# Altium schematic sheet CellMonitorV2.SchDoc
size A2 portrait
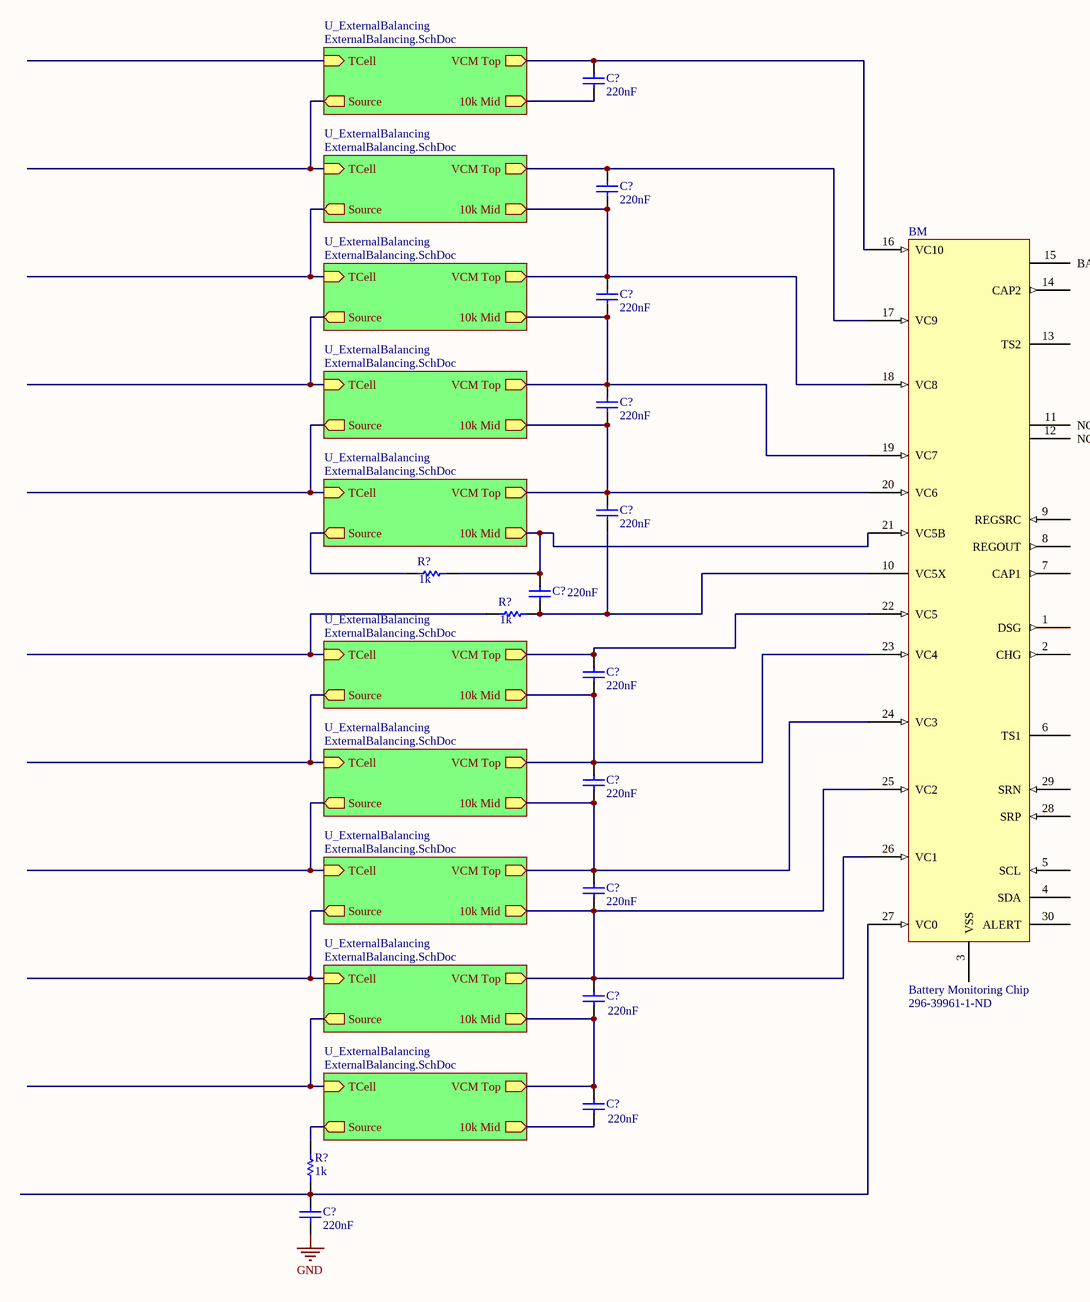
[diagram p0: CellMonitorV2.SchDoc]

## Parts
(Parts that share a designator on the sheet are numbered #1, #2 ... from top to bottom, then left to right.)
BM  Battery Monitoring Chip  Supplier Part Number 1: 296-39961-1-ND  [TSSOP50P640X120-30N]
C?#1  220nF  [CAPC2013X145X50ML20T25]
C?#2  220nF  [CAPC2013X145X50ML20T25]
C?#3  220nF  [CAPC2013X145X50ML20T25]
C?#4  220nF  [CAPC2013X145X50ML20T25]
C?#5  220nF  [CAPC2013X145X50ML20T25]
C?#6  220nF  [CAPC2013X145X50ML20T25]
C?#7  220nF  [CAPC2013X145X50ML20T25]
C?#8  220nF  [CAPC2013X145X50ML20T25]
C?#9  220nF  [CAPC2013X145X50ML20T25]
C?#10  220nF  [CAPC2013X145X50ML20T25]
C?#11  220nF  [CAPC2013X145X50ML20T25]
C?#12  220nF  [CAPC2013X145X50ML20T25]
R?#1  1k  [RESC1608X55X30ML15T15]
R?#2  1k  [RESC1608X55X30ML15T15]
R?#3  1k  [RESC1608X55X30ML15T15]

## Sub-sheets
U_ExternalBalancing = ExternalBalancing.SchDoc: TCell (in), Source (out), 10k Mid (out), VCM Top (out)
U_ExternalBalancing = ExternalBalancing.SchDoc: TCell (in), Source (out), 10k Mid (out), VCM Top (out)
U_ExternalBalancing = ExternalBalancing.SchDoc: TCell (in), Source (out), 10k Mid (out), VCM Top (out)
U_ExternalBalancing = ExternalBalancing.SchDoc: TCell (in), Source (out), 10k Mid (out), VCM Top (out)
U_ExternalBalancing = ExternalBalancing.SchDoc: TCell (in), Source (out), 10k Mid (out), VCM Top (out)
U_ExternalBalancing = ExternalBalancing.SchDoc: TCell (in), Source (out), 10k Mid (out), VCM Top (out)
U_ExternalBalancing = ExternalBalancing.SchDoc: TCell (in), Source (out), 10k Mid (out), VCM Top (out)
U_ExternalBalancing = ExternalBalancing.SchDoc: TCell (in), Source (out), 10k Mid (out), VCM Top (out)
U_ExternalBalancing = ExternalBalancing.SchDoc: TCell (in), Source (out), 10k Mid (out), VCM Top (out)
U_ExternalBalancing = ExternalBalancing.SchDoc: TCell (in), Source (out), 10k Mid (out), VCM Top (out)

## Nets
GND: C?#12.1
NetBM_10: BM.10(VC5X) C?#5.1 C?#6.1 R?#2.2
NetBM_16: BM.16(VC10) C?#1.2 ; sheet U_ExternalBalancing/VCM Top
NetBM_17: BM.17(VC9) C?#2.2 ; sheet U_ExternalBalancing/VCM Top
NetBM_18: BM.18(VC8) C?#2.1 C?#3.2 ; sheet U_ExternalBalancing/10k Mid, sheet U_ExternalBalancing/VCM Top
NetBM_19: BM.19(VC7) C?#3.1 C?#4.2 ; sheet U_ExternalBalancing/10k Mid, sheet U_ExternalBalancing/VCM Top
NetBM_20: BM.20(VC6) C?#4.1 C?#5.2 ; sheet U_ExternalBalancing/10k Mid, sheet U_ExternalBalancing/VCM Top
NetBM_21: BM.21(VC5B) C?#6.2 R?#1.2 ; sheet U_ExternalBalancing/10k Mid
NetBM_22: BM.22(VC5) C?#7.2 ; sheet U_ExternalBalancing/VCM Top
NetBM_23: BM.23(VC4) C?#7.1 C?#8.2 ; sheet U_ExternalBalancing/10k Mid, sheet U_ExternalBalancing/VCM Top
NetBM_24: BM.24(VC3) C?#8.1 C?#9.2 ; sheet U_ExternalBalancing/10k Mid, sheet U_ExternalBalancing/VCM Top
NetBM_25: BM.25(VC2) BM.26(VC1) C?#9.1 C?#10.2 ; sheet U_ExternalBalancing/10k Mid, sheet U_ExternalBalancing/VCM Top
NetBM_27: BM.27(VC0) C?#12.2 R?#3.1
NetC?#1_1: C?#1.1 ; sheet U_ExternalBalancing/10k Mid
NetC?#10_1: C?#10.1 C?#11.2 ; sheet U_ExternalBalancing/10k Mid, sheet U_ExternalBalancing/VCM Top
NetC?#11_1: C?#11.1 ; sheet U_ExternalBalancing/10k Mid
NetR?#1_1: R?#1.1 ; sheet U_ExternalBalancing/Source
NetR?#2_1: R?#2.1 ; sheet U_ExternalBalancing/TCell
NetR?#3_2: R?#3.2 ; sheet U_ExternalBalancing/Source
(unnamed): sheet U_ExternalBalancing/Source, sheet U_ExternalBalancing/TCell
(unnamed): sheet U_ExternalBalancing/Source, sheet U_ExternalBalancing/TCell
(unnamed): sheet U_ExternalBalancing/Source, sheet U_ExternalBalancing/TCell
(unnamed): sheet U_ExternalBalancing/Source, sheet U_ExternalBalancing/TCell
(unnamed): sheet U_ExternalBalancing/Source, sheet U_ExternalBalancing/TCell
(unnamed): sheet U_ExternalBalancing/Source, sheet U_ExternalBalancing/TCell
(unnamed): sheet U_ExternalBalancing/Source, sheet U_ExternalBalancing/TCell
(unnamed): sheet U_ExternalBalancing/Source, sheet U_ExternalBalancing/TCell

Not connected (* = marked no-connect by the designer): BM 1(DSG) 2(CHG) 3(VSS) 4(SDA) 5(SCL) 6(TS1) 7(CAP1) 8(REGOUT) 9(REGSRC) 11(NC) 12(NC) 13(TS2) 14(CAP2) 15(BAT) 28(SRP) 29(SRN) 30(ALERT)

## Library data of the parts
BM = BQ76930: Battery Monitoring/Fuel Gauge Li-Ion/Li-Polymer/LiFePO4 0V to 16V 30-Pin TSSOP T/R; InternalPart: Test1234; Manufacturer: Texas Instruments; Manufacturer Part Number: BQ7693003DBTR; Operating Supply Voltage: 25V; Interface: I2C; Fault Protection: Over Current,Short Circuit,Over/Under Voltage; Supplier 1: Digi-Key; RoHS: Yes; Category: Battery Management; Stock 1: 4521; Pricing 1: 1=4.66000, 10=4.18900, 25=3.96000, 100=3.25600, 250=2.92160, 500=2.81600, 1000=2.34080 (USD); Mount: Surface Mount; Case/Package: TFSOP; Number of Pins: 30; Weight: 0.003439oz; Contact Plating: Gold; Min Operating Temperature: -40°C; Max Operating Temperature: 85°C; Output Voltage: 16V; Packaging: Tape and Reel; Package Quantity: 2000; Lead Free: Lead Free; ComponentLink1URL: http://www.ti.com/lit/gpn/bq76930?src-supplier=Mouser; ComponentLink1Description: http://www.ti.com/lit/gpn/bq76930?src-supplier=Mouser; ComponentLink2URL: http://www.ti.com/lit/ds/symlink/bq76930.pdf?src-supplier=Digi-Key; ComponentLink2Description: http://www.ti.com/lit/ds/symlink/bq76930.pdf?src-supplier=Digi-Key; ComponentLink3URL: http://www.ti.com/lit/pdf/slpt038?src-supplier=Digi-Key; ComponentLink3Description: http://www.ti.com/lit/pdf/slpt038?src-supplier=Digi-Key; ComponentLink4URL: http://www.ti.com/general/docs/lit/getliterature.tsp?genericPartNumber=BQ76920&amp;&amp;fileType=pdf&src-supplier=Avnet+Asia; ComponentLink4Description: http://www.ti.com/general/docs/lit/getliterature.tsp?genericPartNumber=BQ76920&amp;&amp;fileType=pdf&src-supplier=Avnet+Asia; ComponentLink5URL: http://www.ti.com/general/docs/lit/getliterature.tsp?genericPartNumber=BQ76920&&fileType=pdf&src-supplier=Avnet; ComponentLink5Description: http://www.ti.com/general/docs/lit/getliterature.tsp?genericPartNumber=BQ76920&&fileType=pdf&src-supplier=Avnet
C?#1-C?#12 = CMP-2007-01110-1: Part Number: C0805C224J5RACTU; Manufacturer: Kemet
R?#1-R?#3 = CMP-2000-00703-1: Part Number: ERJ-3GEYJ102V; Manufacturer: Panasonic